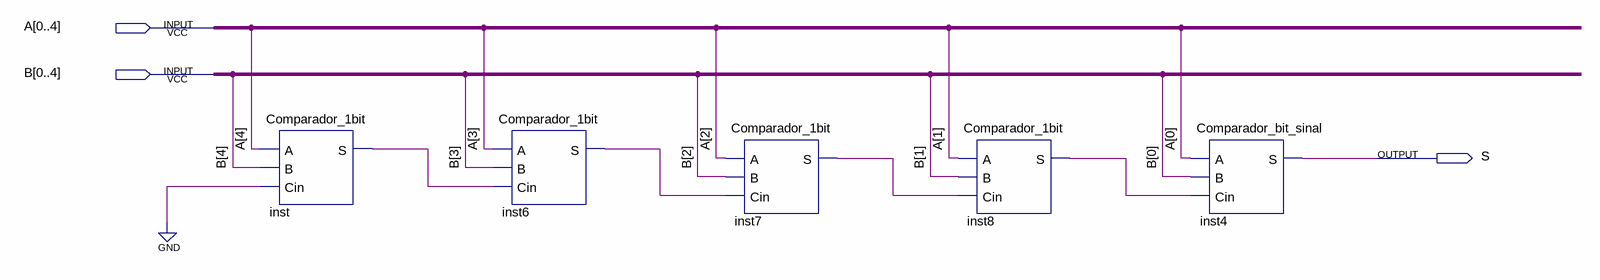
[diagram p0: schematic sheet]
// Quartus schematic Comparador_5bit.bdf as structural Verilog: 5 symbols, 3 pins
module Comparador_5bit (
  input  [0:4] A,
  input  [0:4] B,
  output S
);

  wire inst6_s, inst7_s, inst8_s, inst_s;

  Comparador_1bit inst (.A(A[4]), .B(B[4]), .Cin(1'b0), .S(inst_s));
  Comparador_1bit inst6 (.A(A[3]), .B(B[3]), .Cin(inst_s), .S(inst6_s));
  Comparador_1bit inst7 (.A(A[2]), .B(B[2]), .Cin(inst6_s), .S(inst7_s));
  Comparador_1bit inst8 (.A(A[1]), .B(B[1]), .Cin(inst7_s), .S(inst8_s));
  Comparador_bit_sinal inst4 (.A(A[0]), .B(B[0]), .Cin(inst8_s), .S(S));
endmodule
